# EasyEDA Pro project ProPrj_STM32G431 FOC_2026-07-29.epro, board PCB1
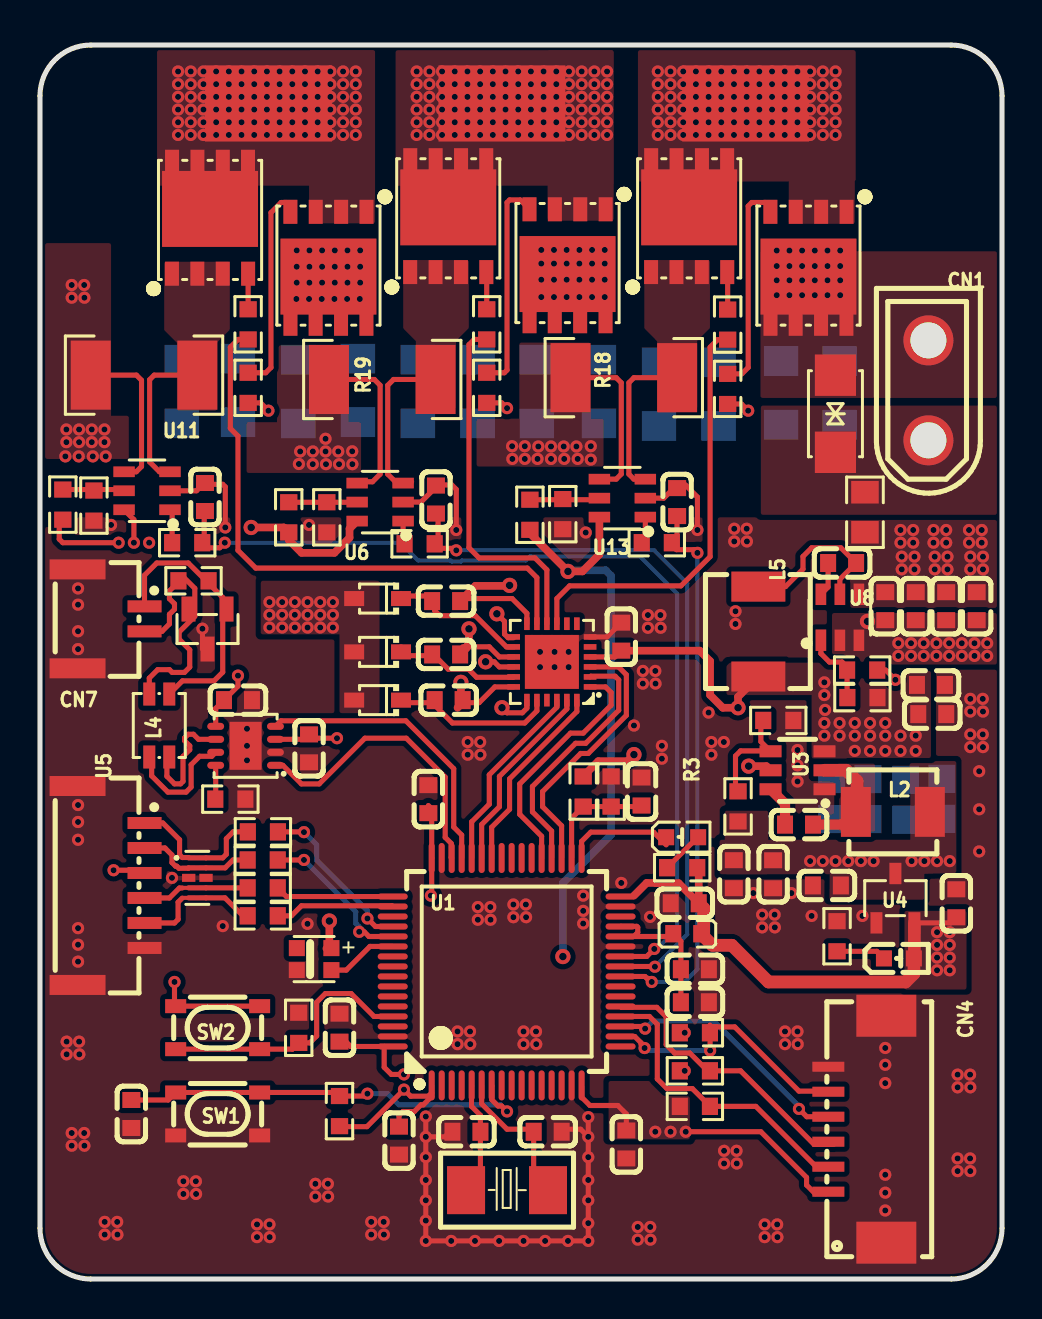
[diagram p1: board, top side]
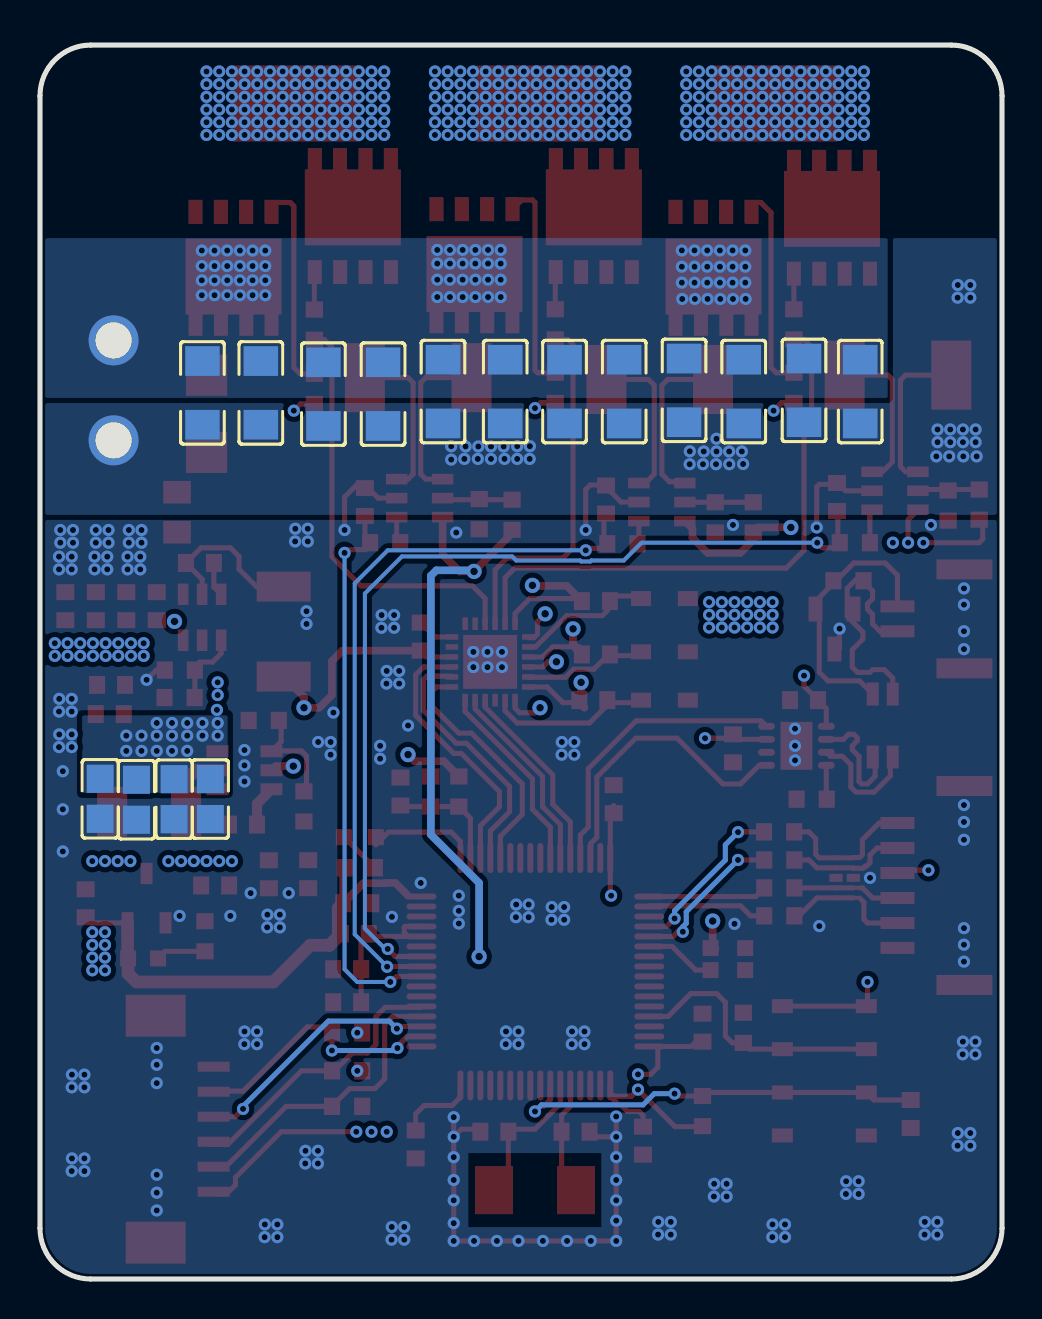
[diagram p2: board, bottom side, seen from below]

Outline 48.13 x 61.72 mm; copper layers: Top Layer, 内电, 内地, Bottom Layer. Coordinates in mm from the lower left corner of the outline.
Outline path: 0,59.18 0,2.54 arc(0.74,0.74) 2.54,0 45.59,0 arc(47.39,0.74) 48.13,2.54 48.13,59.18 arc(47.39,60.98) 45.59,61.72 2.54,61.72 arc(0.74,60.98) 0,59.18
Stack: Top Layer 0.035mm Outer layer thickness 1oz / Dielectric1 0.2104mm 7628 RC49% 8.6mil / 内电 0.0152mm Inner layer thickness / Dielectric2 1.065mm 1.1mm H/HOZ Copper / 内地 0.0152mm Inner layer thickness / Dielectric3 0.2104mm 7628 RC49% 8.6mil / Bottom Layer 0.035mm Outer layer thickness 1oz

## Design rules (mm)
net FDCAN_RX: DP3
net FDCAN_TX: DP3
net CAN1L: DP5
net CAN1H: DP5
net FDCAN1_H: DP4
net FDCAN1_L: DP4
spacing copperThickness1oz (default): track to track 0.102, other pairs 0.152 to 0.3
spacing copperThickness2oz: track to track 0.203, other pairs 0.152 to 0.3
track width copperThickness1oz (default): min 0.127, default 0.254, max 2.54
track width copperThickness2oz: min 0.203, default 0.254, max 2.54
differential pair differentialPair (default): width min 0.127, default 0.254, max 2.54; gap min 0.152, default 0.152
net VCC_INPUT uses copperRegion
net PGND uses copperRegion
net VGS uses copperRegion
net GND uses copperRegion
net $1N50 uses copperRegion
net +5V uses copperRegion
net +3.3V uses copperRegion
net VS1 uses copperRegion
net L3+ uses copperRegion

## Placement (name value [footprint] x y rotation side)
C1  18nF  [C0603]  31.88 38.86 90 top
C2  18nF  [C0603]  19.81 38.99 90 top
C3  100nF  [C0603]  9.91 28.96 180 top
C4  18nF  [C0603]  8.25 39.12 90 top
C5  10uF  [C0603]  44.58 29.72 180 top
C6  10uF  [C0603]  44.64 28.26 180 top
C7  100nF  [C0603]  37.98 22.73 0 top
C8  22uF  [C0603]  34.71 20.25 90 top
C9  22uF  [C0603]  36.68 20.25 90 top
C10  100nF  [C0603]  39.37 19.69 0 top
C11  100nF  [C0603]  45.85 18.79 270 top
C12  10uF  [C1206]  37.08 44.32 90 bottom
C13  10uF  [C1206]  40 44.32 90 bottom
C14  10uF  [C1206]  27.97 44.39 90 bottom
C15  10uF  [C1206]  24.86 44.39 90 bottom
C16  10uF  [C1206]  12.92 44.39 90 bottom
C17  10uF  [C1206]  15.91 44.45 90 bottom
C18  10uF  [C1206]  9.91 44.45 90 bottom
C19  10uF  [C1206]  7.1 44.39 90 bottom
C20  10uF  [C1206]  21.89 44.39 90 bottom
C21  10uF  [C1206]  18.9 44.39 90 bottom
C22  10uF  [C1206]  33.95 44.26 90 bottom
C23  10uF  [C1206]  30.97 44.26 90 bottom
C24  100nF  [C0603]  29.34 6.73 90 top
C25  100nF  [C0603]  19.43 24 270 top
C26  100nF  [C0603]  14.99 12.57 270 top
C27  1uF  [C0603]  29.08 32.13 270 top
C28  100nF  [C0603]  32.26 18.8 0 top
C29  100nF  [C0603]  32.77 15.49 180 top
C30  1uF  [C0603]  20.32 33.91 180 top
C31  100nF  [C0603]  30.1 24.38 270 top
C32  22uF  [C0805]  45.12 24.02 90 bottom
C33  22uF  [C0805]  43.31 23.97 90 bottom
C34  22uF  [C0805]  41.42 24 270 bottom
C35  22uF  [C0805]  39.61 24.01 270 bottom
C36  33pF  [C0603]  25.4 7.37 180 top
C37  100nF  [C0603]  13.46 26.54 90 top
C38  33pF  [C0603]  21.34 7.37 0 top
C39  100nF  [C0603]  4.57 8.26 90 top
C40  100nF  [C0603]  32.77 13.84 180 top
C41  1uF  [C0603]  20.32 31.24 180 top
C42  1uF  [C0603]  20.45 28.96 180 top
C43  100nF  [C0603]  40.13 35.81 180 top
C44  100nF  [C0603]  42.29 33.66 270 top
C45  1uF  [C0603]  43.81 33.66 90 top
C46  1uF  [C0603]  45.34 33.66 90 top
C47  1uF  [C0603]  46.86 33.66 90 top
C48  100nF  [C0603]  17.96 6.92 90 top
CN1  XT30UPB-M  [CONN-TH_XT30UPB-M]  44.45 44.45 90 top
CN4  1.25-6P WT  [CONN-SMD_1.25-6PWT]  40.89 7.49 270 top
CN7  WAFER-GH1.25-2PLB  [CONN-TH_2P-P1.25_XUNPU_WAFER-GH1.25-2PLB]  3.56 33.02 270 top
D1  RCLAMP0524P  [DFN2510-10_L2.5-W1.0-P0.50-BL]  7.87 20.07 270 top
D2  SM712  [SOT-23-3_L2.9-W1.3-P1.90-LS2.4-BR]  8.38 32.51 90 top
D11  B16WS  [SOD-323_L1.8-W1.3-LS2.5-RD]  16.89 34.04 180 top
D12  B16WS  [SOD-323_L1.8-W1.3-LS2.5-RD]  16.89 31.37 180 top
D13  B16WS  [SOD-323_L1.8-W1.3-LS2.5-RD]  16.89 28.96 180 top
L2  3.3uH  [IND-SMD_L4.4-W4.2_SPM4020T]  42.67 23.37 0 top
L3  GZ1608D601TF  [L0603]  32.38 17.27 180 top
L4  ACT1210-510-2P-TL00  [FILTER-SMD_4P-L3.2-W2.5-BL_ACT1210]  5.97 27.69 0 top
L5  15uH  [IND-SMD_L5.7-W5.2_GSM0530]  35.94 32.39 270 top
LED1  KT-0603R  [LED-SMD_L1.6-W0.8-R-RD]  42.97 16.04 0 top
LED2  KT-0603W  [LED0603-R-RD_WHITE]  32.13 22.1 0 top
LED3  WS2812B-2020-V6  [LED-SMD_4P-L2.2-W2.0-P1.00_WS2815C-2020-4P]  13.72 16 0 top
NOREF  -  [Pad_e1544]  23.11 58.8 0 top
NOREF#2  -  [Pad_e1545]  35.31 58.8 0 top
NOREF#3  -  [Pad_e1543]  11.43 58.8 0 top
Q1  HYG053N10NS1C2  [PDFN-8_L5.8-W5.0-P1.27-LS6.2-BL]  38.45 50.58 180 top
Q2  HYG053N10NS1C2  [PDFN-8_L5.8-W5.0-P1.27-LS6.2-BL]  26.4 50.71 180 top
Q3  HYG053N10NS1C2  [PDFN-8_L5.8-W5.0-P1.27-LS6.2-BL]  14.43 50.58 180 top
Q4  HYG053N10NS1C2  [PDFN-8_L5.8-W5.0-P1.27-LS6.2-BL]  32.48 53.17 0 top
Q5  HYG053N10NS1C2  [PDFN-8_L5.8-W5.0-P1.27-LS6.2-BL]  20.43 53.17 0 top
Q6  HYG053N10NS1C2  [PDFN-8_L5.8-W5.0-P1.27-LS6.2-BL]  8.51 53.09 0 top
R1  220Ω  [R0603]  30.86 36.83 0 top
R2  220Ω  [R0603]  18.99 36.78 180 top
R3  56.2kΩ  [R0603]  34.93 23.64 270 top
R4  10kΩ  [R0603]  36.94 27.94 180 top
R5  1kΩ  [R0603]  39.88 17.15 270 top
R6  0Ω  [R0805]  41.28 38.35 270 top
R7  33Ω  [R0603]  34.41 44.52 270 top
R8  1kΩ  [R0603]  9.53 24 0 top
R9  33Ω  [R0603]  22.35 44.58 270 top
R10  33Ω  [R0603]  10.41 44.58 270 top
R11  33Ω  [R0603]  11.15 22.37 180 top
R12  33Ω  [R0603]  11.14 20.96 180 top
R13  33Ω  [R0603]  11.14 19.56 180 top
R14  33Ω  [R0603]  34.41 47.74 270 top
R15  33Ω  [R0603]  11.14 18.17 180 top
R16  33Ω  [R0603]  22.35 47.75 270 top
R17  33Ω  [R0603]  10.41 47.75 270 top
R18  1mΩ  [RES-SMD_L6.3-W3.2_R2512]  29.21 45.09 0 top
R19  1mΩ  [RES-SMD_L6.3-W3.2_R2512]  17.12 45 0 top
R20  1mΩ  [RES-SMD_L6.3-W3.2_R2512]  5.21 45.21 0 top
R21  22kΩ  [R0603]  24.51 38.23 270 top
R22  22kΩ  [R0603]  26.16 38.26 90 top
R23  120Ω  [R0603]  7.68 34.93 0 top
R24  22kΩ  [R0603]  12.45 38.1 270 top
R25  22kΩ  [R0603]  14.35 38.1 90 top
R27  22kΩ  [R0603]  1.14 38.74 270 top
R28  22kΩ  [R0603]  2.7 38.69 90 top
R30  1kΩ  [R0603]  12.95 12.56 90 top
R31  1kΩ  [R0603]  14.99 8.4 270 top
R32  1kΩ  [R0603]  32.13 20.57 180 top
R33  10kΩ  [R0603]  32.77 8.64 0 top
R34  1kΩ  [R0603]  28.57 24.38 270 top
R35  15kΩ  [R0603]  27.18 24.38 90 top
R36  10kΩ  [R0603]  32.77 10.41 0 top
R37  10kΩ  [R0603]  32.77 12.32 0 top
R38  100kΩ  [R0603]  41.15 29.08 180 top
R39  220Ω  [R0603]  7.37 36.83 0 top
R40  8.66kΩ  [R0603]  41.14 30.46 180 top
SW1  SKRPACE010  [KEY-SMD_4P-L4.2-W3.2-P2.20-LS4.6]  8.89 8.26 0 top
SW2  SKRPACE010  [KEY-SMD_4P-L4.2-W3.2-P2.20-LS4.6]  8.89 12.57 0 top
U1  STM32G474RBT6  [LQFP-64_L10.0-W10.0-P0.50-LS12.0-BL]  23.35 15.37 0 top
U3  TPS563209DDCR  [SOT-23-6_L2.9-W1.6-P0.95-LS2.8-BR]  37.9 25.45 0 top
U4  XC6206P332MR-G  [SOT-23-3_L2.9-W1.6-P1.90-LS2.8-BR]  42.8 19.05 270 top
U5  WAFER-GH1.25-6PLB  [CONN-SMD_6P-P1.25_XUNPU_WAFER-GH1.25-6PLB]  3.56 19.69 270 top
U6  INA181A2IDBVR  [SOT-23-6_L2.9-W1.6-P0.95-LS2.8-BL]  17.02 38.86 90 top
U7  SIT1044QTK/3  [TDFN-8_L3.0-W3.0-P0.65-BL-EP]  10.29 26.67 90 top
U8  LMR51625YDDCR  [SOT-23-6_L2.9-W1.6-P0.95-LS2.8-BL]  40.02 33.1 0 top
U9  SMAJ28CA  [DO-214AC_L4.3-W2.7-LS5.0-BI]  39.8 43.28 90 top
U11  INA181A2IDBVR  [SOT-23-6_L2.9-W1.6-P0.95-LS2.8-BL]  5.36 39.43 90 top
U12  JSM6288Q  [VQFN-24_L4.0-W4.0-P0.50-TL-EP2.7]  25.61 30.87 180 top
U13  INA181A2IDBVR  [SOT-23-6_L2.9-W1.6-P0.95-LS2.8-BL]  29.14 39.06 90 top
X1  8MHz  [CRYSTAL-SMD_L5.0-W3.2]  23.37 4.45 180 top

## Footprints (pads in the part's own frame, mm; a bottom-side part is the same pattern mirrored in y, then rotated)
C0603
  rect 0.8x0.9 smd: 1(-0.7,0) 2(0.7,0)
C0805
  rect 1.41x1.35 smd: 1(-1,0) 2(1,0)
C1206
  rect 1.485x1.728 smd: 1(-1.593,0) 2(1.593,0)
CONN-SMD_1.25-6PWT
  rect 0.5x1.6 smd: 1(3.125,-1.45) 2(1.875,-1.45) 3(0.625,-1.45) 4(-0.625,-1.45) 5(-1.875,-1.45) 6(-3.125,-1.45)
  rect 2.1x3 smd: 7(-5.675,1.45) 8(5.675,1.45)
CONN-SMD_6P-P1.25_XUNPU_WAFER-GH1.25-6PLB
  rect 0.6x1.7 smd: 1(-3.125,1.675) 2(-1.875,1.675) 3(-0.625,1.675) 4(0.625,1.675) 5(1.875,1.675) 6(3.125,1.675)
  rect 1x2.8 smd: 7(4.975,-1.675) 8(-4.975,-1.675)
CONN-TH_2P-P1.25_XUNPU_WAFER-GH1.25-2PLB
  rect 0.6x1.7 smd: 1(-0.625,1.675) 2(0.625,1.675)
  rect 1x2.8 smd: 3(2.475,-1.675) 4(-2.475,-1.675)
CONN-TH_XT30UPB-M
  round 2.5 hole 1.8: 1(-2.5,0) 2(2.5,0)
CRYSTAL-SMD_L5.0-W3.2
  rect 1.9x2.4 smd: 1(-2.05,0) 2(2.05,0)
DFN2510-10_L2.5-W1.0-P0.50-BL
  rect 0.2x0.665 smd: 1(-1,-0.433) 2(-0.5,-0.433) 4(0.5,-0.433) 5(1,-0.433) 6(1,0.433) 7(0.5,0.433) 9(-0.5,0.433) 10(-1,0.433)
  rect 0.4x0.665 smd: 3(0,-0.433) 8(0,0.433)
DO-214AC_L4.3-W2.7-LS5.0-BI
  rect 2.07x2.06 smd: 1(-1.929,0) 2(1.929,0)
FILTER-SMD_4P-L3.2-W2.5-BL_ACT1210
  rect 0.6x1.15 smd: 1(-0.5,-1.575) 2(0.5,-1.575) 3(0.5,1.575) 4(-0.5,1.575)
IND-SMD_L4.4-W4.2_SPM4020T
  rect 1.5x2.5 smd: 1(-1.85,0) 2(1.85,0)
IND-SMD_L5.7-W5.2_GSM0530
  rect 1.5x2.7 smd: 1(-2.25,0) 2(2.25,0)
KEY-SMD_4P-L4.2-W3.2-P2.20-LS4.6
  rect 1.05x0.7 smd: 1(-2.1,1.075) 2(2.1,1.075) 3(-2.1,-1.075) 4(2.1,-1.075)
L0603
  rect 0.8x0.864 smd: 1(-0.7,0) 2(0.7,0)
LED0603-R-RD_WHITE
  rect 0.8x0.8 smd: 1(0.8,0) 2(-0.8,0)
LED-SMD_4P-L2.2-W2.0-P1.00_WS2815C-2020-4P
  rect 0.8x0.8 smd: 1(-0.865,0.55) 2(-0.865,-0.55) 3(0.865,-0.55) 4(0.865,0.55)
LED-SMD_L1.6-W0.8-R-RD
  rect 0.8x0.8 smd: 1(0.75,0) 2(-0.75,0)
LQFP-64_L10.0-W10.0-P0.50-LS12.0-BL
  oval 0.3x1.5 smd: 1(-3.75,-5.688) 2(-3.25,-5.688) 3(-2.75,-5.688) 4(-2.25,-5.688) 5(-1.75,-5.688) 6(-1.25,-5.688) 7(-0.75,-5.688) 8(-0.25,-5.688) 9(0.25,-5.688) 10(0.75,-5.688) 11(1.25,-5.688) 12(1.75,-5.688) 13(2.25,-5.688) 14(2.75,-5.688) 15(3.25,-5.688) 16(3.75,-5.688) 33(3.75,5.688) 34(3.25,5.688) 35(2.75,5.688) 36(2.25,5.688) 37(1.75,5.688) 38(1.25,5.688) 39(0.75,5.688) 40(0.25,5.688) 41(-0.25,5.688) 42(-0.75,5.688) 43(-1.25,5.688) 44(-1.75,5.688) 45(-2.25,5.688) 46(-2.75,5.688) 47(-3.25,5.688) 48(-3.75,5.688)
  oval 1.5x0.3 smd: 17(5.7,-3.738) 18(5.7,-3.238) 19(5.7,-2.738) 20(5.7,-2.238) 21(5.7,-1.738) 22(5.7,-1.238) 23(5.7,-0.739) 24(5.7,-0.238) 25(5.7,0.262) 26(5.7,0.762) 27(5.7,1.262) 28(5.7,1.762) 29(5.7,2.261) 30(5.7,2.762) 31(5.7,3.261) 32(5.7,3.762) 49(-5.7,3.762) 50(-5.7,3.261) 51(-5.7,2.762) 52(-5.7,2.261) 53(-5.7,1.762) 54(-5.7,1.262) 55(-5.7,0.762) 56(-5.7,0.262) 57(-5.7,-0.238) 58(-5.7,-0.739) 59(-5.7,-1.238) 60(-5.7,-1.738) 61(-5.7,-2.238) 62(-5.7,-2.738) 63(-5.7,-3.238) 64(-5.7,-3.738)
Pad_e1543
  rect 6.35x3.81 smd: 1(0,0)
Pad_e1544
  rect 6.35x3.81 smd: 1(0,0)
Pad_e1545
  rect 6.35x3.81 smd: 1(0,0)
PDFN-8_L5.8-W5.0-P1.27-LS6.2-BL
  rect 0.7x1.2 smd: 1(-1.905,-2.8) 2(-0.635,-2.8) 3(0.635,-2.8) 4(1.905,-2.8) 5(1.9,2.8) 6(0.64,2.8) 7(-0.63,2.8) 8(-1.9,2.8)
  rect 4.8x3.8 smd: 9(0,0.44)
R0603
  rect 0.806x0.864 smd: 1(-0.753,0) 2(0.753,0)
R0805
  rect 1.133x1.377 smd: 1(-1,0) 2(1,0)
RES-SMD_L6.3-W3.2_R2512
  rect 2x3.456 smd: 1(-2.667,0) 2(2.667,0)
SOD-323_L1.8-W1.3-LS2.5-RD
  rect 1x0.75 smd: 1(-1.173,0) 2(1.173,0)
SOT-23-3_L2.9-W1.3-P1.90-LS2.4-BR
  rect 1.25x0.7 smd: 1(1,-0.95) 2(1,0.95) 3(-1,0)
SOT-23-3_L2.9-W1.6-P1.90-LS2.8-BR
  rect 1.07x0.6 smd: 1(1.235,-0.95) 2(1.235,0.95) 3(-1.235,0)
SOT-23-6_L2.9-W1.6-P0.95-LS2.8-BL
  rect 0.532x1.072 smd: 1(-0.95,-1.149) 2(0,-1.149) 3(0.95,-1.149) 4(0.95,1.149) 5(0,1.149) 6(-0.95,1.149)
SOT-23-6_L2.9-W1.6-P0.95-LS2.8-BR
  rect 1.1x0.6 smd: 1(1.35,-0.95) 2(1.35,0) 3(1.35,0.95) 4(-1.35,0.95) 5(-1.35,0) 6(-1.35,-0.95)
TDFN-8_L3.0-W3.0-P0.65-BL-EP
  oval 0.35x0.84 smd: 1(-0.975,-1.495) 2(-0.325,-1.495) 3(0.325,-1.495) 4(0.975,-1.495) 5(0.975,1.495) 6(0.325,1.495) 7(-0.325,1.495) 8(-0.975,1.495)
  rect 2.4x1.6 smd: 9(0,0)
VQFN-24_L4.0-W4.0-P0.50-TL-EP2.7
  rect 0.633x0.28 smd: 1(-1.911,1.25) 2(-1.911,0.75) 3(-1.911,0.25) 4(-1.911,-0.25) 5(-1.911,-0.75) 6(-1.911,-1.25) 13(1.911,-1.25) 14(1.911,-0.75) 15(1.911,-0.25) 16(1.911,0.25) 17(1.911,0.75) 18(1.911,1.25)
  rect 0.28x0.633 smd: 7(-1.25,-1.911) 8(-0.75,-1.911) 9(-0.25,-1.911) 10(0.25,-1.911) 11(0.75,-1.911) 12(1.25,-1.911) 19(1.25,1.911) 20(0.75,1.911) 21(0.25,1.911) 22(-0.25,1.911) 23(-0.75,1.911) 24(-1.25,1.911)
  rect 2.7x2.7 smd: 25(0,0)

## Nets
As in the schematic, except:
VS1: C30.1 NOREF#2.1 Q1.1 Q1.2 Q1.3 Q4.5 Q4.6 Q4.7 Q4.8 Q4.9 U12.12
VS2: C41.1 NOREF.1 Q2.1 Q2.2 Q2.3 Q5.5 Q5.6 Q5.7 Q5.8 Q5.9 U12.15
VS3: C42.1 NOREF#3.1 Q3.1 Q3.2 Q3.3 Q6.5 Q6.6 Q6.7 Q6.8 Q6.9 U12.18

Pads without a net: LED3 1; U1 2 3 4 8 9 10 11 12 13 14 17 22 23 30 38 39 40 41 51 55 56 57 58 59 60 62; U12 5 7 8 21

## Via types
v1: diameter 0.61, hole 0.305, Top Layer to Bottom Layer, 695 vias
v2: diameter 0.762, hole 0.381, Top Layer to Bottom Layer, 14 vias

## Routing (per net, layer and track width the routed paths; a pad name or vN(x,y) marks a point on that pad's centre or on a via; arc(x,y) is an arc through that point)
+3.3V: length 106.8
  Top Layer w0.254: U7.5 8.79,28.54 C3.2 9.91,29.66 v1(9.91,30.18) ; v1(18.21,10.24) 17.58,10.24 17.22,10.59 17.22,11.63 ; C48.2 17.96,8.18 18.16,8.38 18.73,8.38 19.06,8.71 19.18,8.71 19.6,9.13 19.6,9.31 ; v1(3.94,36.83) 1.14,36.83 0.96,37.01 0.96,37.8 R27.2 ; 19.6,9.31 19.43,9.14 18.54,9.14 v1(18.21,9.47) 16.36,7.62 15.01,7.62 R31.2 ; 19.6,9.31 19.6,9.68 ; U11.6 4.7,37.99 v1(4.7,36.83) ; v1(6.73,14.86) 6.73,13.71 SW2.1 10.99,13.65 ; v1(3.68,20.45) 5.09,20.45 U5.3 ; 17.22,11.63 15.55,11.63 15.31,11.87 C26.2 ; 17.22,11.63 U1.64 ; U4.2 45.57,17.82 C11.2 ; 19.43,23.68 19.6,23.52 U1.48 19.6,19.22 v1(19.56,19.18) ; C24.2 29.34,8.26 28.91,8.68 27.52,8.68 27.1,9.1 27.1,9.68 ; 39.44,4.37 39.34,4.27 38.79,4.27 38.35,4.7 38.35,5.08 36.07,7.37 v1(32.31,7.37)
  Top Layer w0.381: 29.72,19.18 30.35,19.81 30.82,19.81 30.83,19.8 31.95,19.8 C28.2 32.96,20.5 R32.1 ; v2(10.57,37.59) 12.2,37.59 R24.2 12.45,36.97 13.09,36.32 14.73,36.32 15.49,37.08 15.49,37.53 U6.6 ; U13.6 27.99,36.24 27.14,35.39 v2(26.42,35.39) 24.51,37.3 R21.2
  Top Layer w0.635: U4.2 43.75,16.06 LED1.1 43.72,15.28 43.31,14.86 36.45,14.86 34.62,16.69 33.65,16.69 33.21,17.13 33.21,18.55 C28.2
  Bottom Layer w0.381: v2(26.42,35.39) 26.47,35.45 28.31,35.45 28.57,35.18 28.57,22.23 26.16,19.81 v2(26.16,16.13)
  vias: v1(5.46,36.83) v1(30.78,7.37) v1(31.55,7.37) v1(32.26,12.32) v1(32.26,10.41) v1(44.88,17.35) v1(44.88,16.71) v1(44.88,16.08) v1(44.88,15.44) v1(45.52,17.35) v1(45.52,16.71) v1(45.52,16.08) v1(45.52,15.44)
+5V: length 4.7
  Top Layer w0.254: U7.3 13.21,27 C37.2 13.65,27.05 v1(14.86,27.05)
  Top Layer w0.381: v2(14.48,17.91) 14.48,16.68 14.33,16.53
  vias: v1(38.53,20.9) v1(39.17,20.9) v1(39.8,20.9) v1(40.44,20.9) v1(41.07,20.9) v1(41.71,20.9) v1(43.61,20.9) v1(44.25,20.9) v1(44.88,20.9) v1(45.52,20.9)
GND: length 42.8
  Top Layer w0.254: v1(19.3,7.11) v1(19.3,6.1) v1(19.3,4.95) v1(19.3,3.94) v1(19.3,2.92) v1(19.3,1.91) v1(20.57,1.91) v1(21.76,1.91) v1(22.97,1.91) v1(24.19,1.91) v1(25.27,1.91) v1(26.42,1.91) v1(27.43,1.91) v1(27.43,2.79) v1(27.43,3.94) v1(27.43,4.95) v1(27.43,6.1) v1(27.43,7.11) ; v1(19.3,7.11) v1(19.3,8.13) ; v1(19.3,7.11) 20.25,7.11 20.64,7.49 ; R40.1 42.31,30.46 v1(42.8,29.97) ; v1(9.27,37.59) 9.27,39.62 9.14,39.75 8.28,39.75 8.22,39.81 7.83,39.43 U11.2 ; v1(32.89,37.47) 32.89,39.12 32.29,39.72 31.87,39.72 31.21,39.06 U13.2 ; v1(20.83,37.47) 20.83,39.5 20.6,39.72 19.92,39.72 19.06,38.86 17.8,38.86 ; v1(8.13,32.53) 8.13,31.51 ; v1(27.43,7.11) v1(27.43,8.1) ; v1(27.43,7.11) 27.05,7.49 26.1,7.49 ; U12.6 28.37,32.12 C27.1
  vias: v1(1.33,11.87) v1(1.33,11.24) v1(1.59,7.3) v1(1.59,6.67) v1(1.91,34.54) v1(1.91,33.73) v1(1.91,32.4) v1(1.91,31.51) v1(1.91,23.71) v1(1.91,22.86) v1(1.91,21.97) v1(1.91,17.55) v1(1.91,16.72) v1(1.91,15.88) v1(1.96,11.87) v1(1.97,11.24) v1(2.21,7.3) v1(2.22,6.67) v1(3.24,2.86) v1(3.24,2.22) v1(3.56,37.72) v1(3.86,2.86) v1(3.87,2.22) v1(6.6,20.07) v1(7.18,4.89) v1(7.18,4.25) v1(7.8,4.89) v1(7.81,4.25) v1(9.14,17.65) v1(10.36,27.52) v1(10.36,26.67) v1(10.36,25.94) v1(10.86,2.73) v1(10.86,2.1) v1(11.48,2.73) v1(11.49,2.1) v1(13.38,17.77) v1(13.46,37.72) v1(13.78,4.76) v1(13.78,4.13) v1(14.4,4.76) v1(14.41,4.13) v1(16.57,2.86) v1(16.57,2.22) v1(17.2,2.86) v1(17.21,2.22) v1(20.89,12.38) v1(20.89,11.75) v1(21.4,26.86) v1(21.4,26.23) v1(21.52,12.38) v1(21.53,11.75) v1(21.91,18.61) v1(21.91,17.97) v1(22.02,26.86) v1(22.03,26.23) v1(22.53,18.61) v1(22.54,17.97) v1(23.69,18.73) v1(23.69,18.1) v1(24.19,12.38) v1(24.19,11.75) v1(24.31,18.73) v1(24.32,18.1) v1(24.82,12.38) v1(24.83,11.75) v1(25.02,31.37) v1(25.02,30.61) v1(25.75,31.37) v1(25.75,30.61) v1(26.45,31.37) v1(26.45,30.61) v1(27.18,19.18) v1(27.18,18.42) v1(27.18,17.78) v1(27.31,37.34) v1(29.08,19.81) v1(29.72,27.69) v1(29.91,2.6) v1(29.91,1.97) v1(30.16,30.42) v1(30.16,29.78) v1(30.42,33.21) v1(30.42,32.58) v1(30.53,18.12) v1(30.53,2.6) v1(30.54,1.97) v1(30.79,30.42) v1(30.8,29.78) v1(31.04,33.21) v1(31.05,32.58) v1(31.12,26.67) v1(31.12,26.03) v1(33.45,28.33) v1(33.59,26.86) v1(33.59,26.23) v1(34.22,26.86) v1(34.23,6.41) v1(34.23,5.78) v1(34.73,37.53) v1(34.73,36.89) v1(34.8,33.4) v1(34.8,32.77) v1(34.85,6.41) v1(34.86,5.78) v1(35.36,37.53) v1(35.37,36.89) v1(35.69,19.3) v1(36.13,18.22) v1(36.13,17.59) v1(36.26,2.73) v1(36.26,2.1) v1(36.76,18.22) v1(36.77,17.59) v1(36.88,2.73) v1(36.89,2.1) v1(37.27,12.38) v1(37.27,11.75) v1(37.59,19.3) v1(37.9,26.46) v1(37.9,25.69) v1(37.9,24.89) v1(37.9,12.38) v1(37.91,11.75) v1(38.61,18.16) v1(41.15,18.16) v1(42.29,11.56) v1(42.29,10.72) v1(42.29,9.8) v1(42.29,5.22) v1(42.29,4.32) v1(42.29,3.43) v1(43.05,37.47) v1(43.05,36.83) v1(43.12,36.13) v1(43.12,35.5) v1(43.69,37.47) v1(43.69,36.83) v1(43.75,36.13) v1(43.75,35.5) v1(44.7,37.47) v1(44.7,36.83) v1(44.77,36.13) v1(44.77,35.5) v1(45.34,37.47) v1(45.34,36.83) v1(45.4,36.13) v1(45.4,35.5) v1(45.91,10.22) v1(45.91,9.59) v1(45.91,6.03) v1(45.91,5.4) v1(46.48,37.47) v1(46.48,36.83) v1(46.55,36.13) v1(46.55,35.5) v1(46.55,29.02) v1(46.55,28.38) v1(46.55,27.24) v1(46.55,26.61) v1(46.53,10.22) v1(46.55,9.59) v1(46.53,6.03) v1(46.55,5.4) v1(46.99,25.4) v1(46.99,23.5) v1(46.99,21.39) v1(47.12,37.47) v1(47.12,36.83) v1(47.18,36.13) v1(47.18,35.5) v1(47.17,29.02) v1(47.18,28.38) v1(47.17,27.24) v1(47.18,26.61)
PGND: length 25.1
  Top Layer w0.254: U11.4 4.82,40.38 5.08,40.64 5.08,44.96 4.83,45.21 R20.1 ; 15.57,39.88 16.64,39.88 17.02,40.26 17.02,44.7 16.73,45 R19.1 ; R18.1 28.83,45.09 29.08,44.83 29.08,40.26 28.83,40.01 U13.4
  vias: v1(1.27,41.15) v1(1.32,42.49) v1(1.32,41.86) v1(1.59,49.72) v1(1.59,49.09) v1(1.96,42.49) v1(1.96,41.86) v1(1.94,41.15) v1(2.21,49.72) v1(2.22,49.09) v1(2.59,42.49) v1(2.59,41.86) v1(2.64,41.15) v1(3.23,42.49) v1(3.23,41.86) v1(3.29,41.15) v1(12.95,40.77) v1(13.02,41.39) v1(13.65,41.39) v1(13.65,40.76) v1(14.29,42.03) v1(14.29,41.39) v1(14.31,40.76) v1(14.92,41.39) v1(14.96,40.76) v1(15.62,41.4) v1(15.63,40.76) v1(23.62,41.66) v1(23.63,41.02) v1(24.26,41.66) v1(24.26,41.02) v1(24.93,41.64) v1(24.89,41.02) v1(25.57,41.64) v1(25.57,41.02) v1(26.2,41.64) v1(26.23,41.02) v1(26.84,41.64) v1(26.9,41.02) v1(27.56,41.66) v1(27.56,40.99)
VCC_INPUT: length 19.5
  Top Layer w0.381: v2(29.72,26.23) 29.39,25.9 27.93,25.9 27.17,25.14
  内电 w0.381: v2(29.72,26.23) 29.72,26.67 30.73,27.69 33.78,27.69 34.16,28.07 34.16,31.12 35.94,32.89 v2(41.4,32.89)
  vias: v1(12.84,51.45) v1(12.84,50.63) v1(12.84,49.84) v1(12.83,49.02) v1(13.48,51.45) v1(13.48,50.63) v1(13.48,49.84) v1(13.46,49.02) v1(14.12,51.45) v1(14.12,50.63) v1(14.12,49.84) v1(14.1,49.02) v1(14.75,51.45) v1(14.75,50.63) v1(14.75,49.84) v1(14.73,49.02) v1(15.38,51.45) v1(15.38,50.63) v1(15.38,49.84) v1(15.37,49.02) v1(16.02,51.45) v1(16.02,50.63) v1(16.02,49.84) v1(16,49.02) v1(25.08,51.47) v1(25.08,50.79) v1(25.08,49.99) v1(25.08,49.12) v1(25.72,51.47) v1(25.72,50.79) v1(25.72,49.99) v1(25.72,49.12) v1(26.35,51.47) v1(26.35,50.79) v1(26.35,49.99) v1(26.35,49.12) v1(26.99,51.47) v1(26.99,50.79) v1(26.99,49.99) v1(26.99,49.12) v1(27.62,51.47) v1(27.62,50.79) v1(27.62,49.99) v1(27.62,49.12) v1(28.26,51.47) v1(28.26,50.79) v1(28.26,49.99) v1(28.26,49.12) v1(36.86,51.44) v1(36.86,50.67) v1(36.86,49.95) v1(36.86,49.21) v1(37.5,51.44) v1(37.5,50.67) v1(37.5,49.95) v1(37.5,49.21) v1(38.13,51.44) v1(38.13,50.67) v1(38.13,49.95) v1(38.13,49.21) v1(38.77,51.44) v1(38.77,50.67) v1(38.77,49.95) v1(38.77,49.21) v1(39.4,51.44) v1(39.4,50.67) v1(39.4,49.95) v1(39.4,49.21) v1(40.04,51.44) v1(40.04,50.67) v1(40.04,49.95) v1(40.04,49.21) v1(42.94,31.8) v1(42.94,31.17) v1(43.58,31.8) v1(43.58,31.17) v1(44.22,31.8) v1(44.22,31.17) v1(44.85,31.8) v1(44.85,31.17) v1(45.48,31.8) v1(45.48,31.17) v1(46.12,31.8) v1(46.12,31.17) v1(46.75,31.8) v1(46.75,31.17) v1(47.39,31.8) v1(47.39,31.17)
VDDA: length 7.7
  Top Layer w0.254: 29.71,17.13 29.91,17.34 29.91,17.59 29.86,17.64 29.06,17.64 U1.29 ; 29.71,17.13 U1.28 ; 29.71,17.13 31.55,17.13 L3.2 32.07,16.89 C29.2 C40.2
ADC_L1: length 28
  Top Layer w0.254: 31.87,38.32 31.87,36.51 31.85,36.48 32.73,36.48 v1(32.89,36.32) ; U1.24 30.27,15.13 30.37,15.04 30.43,15.04 v1(30.61,14.86)
  Bottom Layer w0.203: v1(32.89,36.32) 32.89,15.49 32.26,14.86 v1(30.61,14.86)
ADC_L2: length 36.7
  Top Layer w0.254: U1.25 30.75,15.63 v1(30.77,15.62) ; v1(20.83,36.45) 20.73,36.55 19.79,36.55 19.92,36.68 19.92,38.32
  Bottom Layer w0.203: v1(20.83,36.45) 30.73,36.45 32.38,34.8 32.38,17.24 v1(30.77,15.62)
ADC_L3: length 47.1
  Top Layer w0.254: 8.22,38.41 8.22,36.64 8.15,36.58 8.99,36.58 v1(9.25,36.83) ; v1(30.73,16.51) 30.36,16.13 U1.26
  Bottom Layer w0.203: v1(9.25,36.83) 18.03,36.83 18.92,35.94 20.55,35.94 20.6,35.89 21.06,35.89 21.11,35.94 24.31,35.94 24.51,36.14 30.02,36.14 31.88,34.29 31.88,17.53 30.86,16.51 v1(30.73,16.51)
ADC_MAIN: length 3.8
  Top Layer w0.254: 30.1,23.68 30.05,23.63 28.57,23.63 27.18,23.63 26.6,23.05
ADC_main: length 2
  Top Layer w0.254: U1.34 26.6,23.05
BOOT0: length 13.5
  Top Layer w0.254: SW2.3 12.63,11.5 R30.1 13.5,11.81 13.84,12.16 13.84,13.84 14.28,14.28 15.57,14.28 16.71,13.13 U1.61
CAN1H: length 13.1
  Top Layer w0.254: CN7.2 6.11,32.4 6.48,32.77 6.48,33.25 6.73,33.5 6.73,33.77 6.48,34.03 6.48,34.42 6.73,34.67 6.73,35.18 7.11,35.18 7.75,34.54 7.75,33.15 6.96,32.36 6.96,32 7.49,31.47 7.49,30.61 7.23,30.34 6.62,30.34 6.48,30.48 5.89,30.48 5.47,30.06 L4.4
CAN1L: length 13.3
  Top Layer w0.254: L4.3 7.13,29.92 8.71,29.92 9.14,30.35 9.14,34.09 7.42,35.81 5.84,35.81 5.23,35.2 CN7.1
ENC_CLK: length 12.7
  Top Layer w0.254: v1(30.28,12.52) 30.17,12.63 U1.19 ; v1(37.97,8.51) 38.36,8.12 39.44,8.12
  Bottom Layer w0.254: v1(37.97,8.51) 37.97,8.64 33.71,12.9 30.66,12.9 v1(30.28,12.52)
ENC_CS: length 13.4
  Top Layer w0.254: v1(33.53,11.43) 33.53,12.53 33.61,12.61 ; v1(30.25,11.55) 30.08,11.73 30.08,11.81 29.75,12.13 U1.18 ; 33.61,12.61 34.76,12.61 37.97,9.4 39.54,9.4 ; 33.61,12.61 33.52,12.7
  Bottom Layer w0.254: v1(33.53,11.43) 30.37,11.43 v1(30.25,11.55)
ENC_MISO: length 15.3
  Top Layer w0.254: U1.20 30.49,13.13 30.89,12.74 30.89,10.01 31.37,9.53 32.64,9.53 33.53,8.64 35.81,8.64 38.86,5.59 39.6,5.59
ENC_MOSI: length 14.3
  Top Layer w0.254: 39.71,6.73 38.73,6.73 35.05,10.41 33.4,10.41 32.51,11.3 31.75,11.3 31.33,11.72 31.33,13.12 30.86,13.59 29.09,13.59 U1.21
FDCAN1_H: length 6.2
  Top Layer w0.254: U7.7 8.6,26.15 7.99,26.15 7.56,25.72 7.56,24.61 7.31,24.35 6.4,24.35 5.59,25.17 5.59,26.37
FDCAN1_L: length 6.2
  Top Layer w0.254: 6.73,24.77 6.35,25.15 6.35,25.99 6.47,26.11 ; 6.73,24.77 7.03,24.77 7.16,24.89 7.16,26.14 7.49,26.47 7.49,26.67 7.24,26.92 7.24,27.07 7.42,27.25 7.68,27.25 7.93,27 U7.6
FDCAN_RX: length 14.7
  Top Layer w0.254: U7.4 12.06,27.92 18.31,27.92 20.7,25.53 20.7,22.61 21.1,22.21 U1.45
FDCAN_TX: length 14.8
  Top Layer w0.254: U1.46 20.57,21.08 20.57,21.79 20.27,22.09 20.27,25.11 18.33,27.05 16.26,27.05 13.97,24.77 13.08,24.77 12.15,25.7 U7.1
HIN1: length 9.7
  Top Layer w0.254: U12.24 26.86,28.39 23.5,25.02 23.5,23.5 22.6,22.6 U1.42
HIN2: length 9.7
  Top Layer w0.254: U12.23 26.36,28.52 22.99,25.14 22.99,23.62 22.1,22.73 U1.43
HIN3: length 9.7
  Top Layer w0.254: U1.44 21.6,22.87 22.48,23.75 22.48,25.22 25.86,28.6 U12.22
HO1: length 24.6
  Top Layer w0.254: v1(35.43,43.43) 35.1,43.77 R7.2 ; 23.7,32.08 23.42,32.08 23.24,32.26 23.24,32.89 v2(22.86,33.27)
  内电 w0.254: v1(35.43,43.43) 34.15,42.15 34.15,34.4 33.78,34.04 22.99,34.04 22.86,33.91 v2(22.86,33.27)
HO2: length 15.8
  Top Layer w0.254: R9.2 23.11,43.82 v1(23.37,43.56) ; 23.7,30.62 22.98,30.62 22.72,30.87 v2(22.29,30.87)
  内电 w0.254: v2(22.29,30.87) 22.2,30.97 22.2,41.63 23.37,42.8 v1(23.37,43.56)
HO3: length 27.9
  Top Layer w0.254: v2(23.11,28.58) 23.37,28.32 24.13,28.32 24.36,28.55 U12.19 ; R10.2 11.04,43.82 v1(11.43,43.43)
  内电 w0.254: v2(23.11,28.58) 20.45,28.58 20.07,28.96 20.07,34.8 19.43,35.43 13.21,35.43 11.43,37.21 v1(11.43,43.43)
L1+: length 8
  Top Layer w0.254: U13.3 29.71,40.01 29.46,40.26 29.46,44.83 29.72,45.09 R18.2
L2+: length 8.3
  Top Layer w0.254: 18.59,39.88 17.78,39.88 17.4,40.26 17.4,44.7 17.69,45 R19.2
L3+: length 7.8
  Top Layer w0.254: R20.2 5.72,45.21 5.49,44.98 5.49,40.87 5.98,40.38 U11.3
LIN1: length 13.5
  Top Layer w0.254: U1.35 26.1,22.67 25.15,23.62 25.15,24.38 27.05,26.29 27.43,26.29 29.34,28.19 29.34,30.23 28.95,30.62 U12.3
LIN2: length 12.9
  Top Layer w0.254: U1.36 25.6,22.41 24.64,23.37 24.64,24.64 26.8,26.8 27.31,26.8 28.96,28.45 28.96,29.97 28.78,30.15 27.56,30.15 U12.2
LIN3: length 12.2
  Top Layer w0.254: U12.1 28.29,29.62 28.57,29.34 28.57,28.7 27.18,27.31 26.54,27.31 24,24.77 24,23.24 25.1,22.15 U1.37
LO1: length 21.3
  Top Layer w0.254: U12.9 25.86,34.04 26.5,34.67 32.07,34.67 33.53,36.13 33.53,46.61 33.9,46.99 34.41,46.99
LO2: length 18.2
  Top Layer w0.254: U12.10 25.36,35.47 24.76,36.07 21.97,36.07 21.46,36.58 21.46,46.74 21.73,47 R16.2
LO3: length 29.2
  Top Layer w0.254: U12.11 24.86,35.08 24.38,35.56 10.79,35.56 9.91,36.45 9.91,42.16 9.53,42.55 9.53,46.61 9.91,47 R17.2
NRST: length 21.2
  Top Layer w0.254: C39.2 6.41,8.96 SW1.1 14.81,9.33 14.99,9.15 16.26,9.15 v1(16.38,9.27) ; v1(23.37,8.38) 23.1,8.65 22.92,8.65 22.61,8.97 22.61,9.68 22.6,9.68
  Bottom Layer w0.254: v1(23.37,8.38) 23.04,8.71 17.96,8.71 17.4,9.27 v1(16.38,9.27)
RCC_OSC_IN: length 5.6
  Top Layer w0.254: 21.32,4.57 22.04,5.29 22.04,8.19 21.59,8.64 21.59,9.67 21.6,9.68
RCC_OSC_OUT: length 7.1
  Top Layer w0.254: 22.1,9.68 22.1,8.76 23.37,7.49 24.45,7.49 24.7,7.24 24.7,5.29 25.42,4.57
SWCLK: length 6
  Top Layer w0.254: U1.50 17.61,18.67 13.08,18.67 12.58,18.17 R15.1
SWCLK1: length 6.2
  Top Layer w0.254: U5.5 6.73,17.81 6.91,17.99 6.91,18.85 7.11,19.05 ; D1.5 D1.6 9.25,19.07 10.15,18.17 R15.2
SWDIO: length 5.9
  Top Layer w0.254: U1.49 12.33,19.13 R13.1
SWDIO1: length 5
  Top Layer w0.254: D1.4 D1.7 10.39,19.57 R13.2 ; U5.4 6.48,19.06 6.97,19.56 7.11,19.56
UART4_RX: length 6
  Top Layer w0.254: U5.2 6.25,21.56 6.6,21.21 6.6,20.83 6.78,20.65 6.85,20.65 6.95,20.55 7.42,20.55 D1.2 D1.9 9.26,20.57 9.66,20.96 R12.2
UART4_RX(PC11): length 7.8
  Top Layer w0.254: R12.1 13.21,20.96 ; U1.53 16.46,17.13 16.22,17.37 v1(15.97,17.37)
  Bottom Layer w0.254: v1(13.21,20.96) 15.8,18.37 15.8,17.79 15.97,17.62 v1(15.97,17.37)
UART4_TX: length 7.3
  Top Layer w0.254: D1.1 D1.10 9.14,21.07 9.32,21.25 9.32,22.02 9.67,22.37 R11.2 ; 7.44,21.08 7.12,21.08 6.98,21.22 6.98,21.97 6.15,22.81 U5.1
UART4_TX(PC10): length 8.4
  Top Layer w0.254: R11.1 13.19,22.37 v1(13.21,22.35) ; v1(16.38,18.03) 16.78,17.63 U1.52
  Bottom Layer w0.254: v1(13.21,22.35) 13.84,21.72 13.84,20.96 16.38,18.42 v1(16.38,18.03)
VB1: length 7.1
  Top Layer w0.254: 23.7,31.62 23.34,31.62 21.78,33.18 20,33.18 19.75,33.43 19.75,34.04 19.62,34.16 18.19,34.16 18.06,34.29
VB2: length 6.4
  Top Layer w0.254: 23.7,30.12 23.68,30.1 21.84,30.1 21.44,30.51 20.42,30.51 19.75,31.18 18.35,31.18 18.06,31.47 18.06,31.62
VB3: length 7.9
  Top Layer w0.254: U12.20 24.86,28.42 24.26,27.81 20.64,27.81 19.62,28.83 18.19,28.83
VGS: length 16.1
  Top Layer w0.254: U12.4 28.77,31.12 C27.2
  Top Layer w0.381: L5.2 34.93,29.12 v2(34.93,28.58) 34.16,28.58 33.53,29.21 33.53,30.91 33,31.43 C27.2 ; v2(35.46,25.65) 36.34,25.65 U3.5
  内电 w0.381: v2(34.93,28.58) 34.93,25.91 35.32,25.51
  vias: v1(11.48,33.86) v1(11.48,33.22) v1(11.48,32.59) v1(12.12,33.86) v1(12.12,33.22) v1(12.12,32.59) v1(12.75,33.86) v1(12.75,33.22) v1(12.75,32.59) v1(13.39,33.86) v1(13.39,33.22) v1(13.39,32.59) v1(14.02,33.86) v1(14.02,33.22) v1(14.02,32.59) v1(14.66,33.86) v1(14.66,33.22) v1(14.66,32.59) v1(39.24,29.85) v1(39.24,29.21) v1(39.28,28.47) v1(39.24,27.81) v1(39.24,27.18) v1(40,27.81) v1(40,27.18) v1(40.77,27.81) v1(40.77,27.18) v1(40.77,26.42) v1(41.53,27.81) v1(41.53,27.18) v1(41.53,26.42) v1(42.29,27.81) v1(42.29,27.18) v1(42.29,26.42) v1(43.05,27.18) v1(43.05,26.42) v1(43.81,27.18) v1(43.81,26.42)
VS1: length 39.9
  Top Layer w0.254: 21.27,34.04 23.62,34.04 24.36,33.3 U12.12
  Top Layer w0.381: C30.1 21.78,34.67 23.47,34.67 23.5,34.7
  内电 w0.381: v1(35.36,57.23) 35.36,51.49 33.54,49.67 33.54,35.05 33.16,34.67 23.52,34.67 23.5,34.7
  vias: v1(30.91,60.4) v1(30.91,59.77) v1(30.91,59.13) v1(30.91,58.5) v1(30.91,57.86) v1(30.91,57.23) v1(31.55,60.4) v1(31.55,59.77) v1(31.55,59.13) v1(31.55,58.5) v1(31.55,57.86) v1(31.55,57.23) v1(32.18,60.4) v1(32.18,59.77) v1(32.18,59.13) v1(32.18,58.5) v1(32.18,57.86) v1(32.18,57.23) v1(32.82,60.4) v1(32.82,59.77) v1(32.82,59.13) v1(32.82,58.5) v1(32.82,57.86) v1(32.82,57.23) v1(33.45,60.4) v1(33.45,59.77) v1(33.45,59.13) v1(33.45,58.5) v1(33.45,57.86) v1(33.45,57.23) v1(34.09,60.4) v1(34.09,59.77) v1(34.09,59.13) v1(34.09,58.5) v1(34.09,57.86) v1(34.09,57.23) v1(34.72,60.4) v1(34.72,59.77) v1(34.72,59.13) v1(34.72,58.5) v1(34.72,57.86) v1(34.72,57.23) v1(35.36,60.4) v1(35.36,59.77) v1(35.36,59.13) v1(35.36,58.5) v1(35.36,57.86) v1(35.99,60.4) v1(35.99,59.77) v1(35.99,59.13) v1(35.99,58.5) v1(35.99,57.86) v1(35.99,57.23) v1(36.63,60.4) v1(36.63,59.77) v1(36.63,59.13) v1(36.63,58.5) v1(36.63,57.86) v1(36.63,57.23) v1(37.26,60.4) v1(37.26,59.77) v1(37.26,59.13) v1(37.26,58.5) v1(37.26,57.86) v1(37.26,57.23) v1(37.9,60.4) v1(37.9,59.77) v1(37.9,59.13) v1(37.9,58.5) v1(37.9,57.86) v1(37.9,57.23) v1(38.53,60.4) v1(38.53,59.77) v1(38.53,59.13) v1(38.53,58.5) v1(38.53,57.86) v1(38.53,57.23) v1(39.17,60.4) v1(39.17,59.77) v1(39.17,59.13) v1(39.17,58.5) v1(39.17,57.86) v1(39.17,57.23) v1(39.8,60.4) v1(39.8,59.77) v1(39.8,59.13) v1(39.8,58.5) v1(39.8,57.86) v1(39.8,57.23)
vs1:
  vias: v2(23.5,34.7)
VS2: length 29.7
  Top Layer w0.254: 21.15,31.62 22.48,31.62 22.98,31.12 23.7,31.12
  Top Layer w0.381: v2(21.46,32.52) 21.46,31.75 21.34,31.62 21.34,31.56 C41.1
  内电 w0.381: v2(21.46,32.52) 21.48,32.53 21.48,49.8 23.29,51.61 v1(23.29,57.23)
  vias: v1(18.85,60.4) v1(18.85,59.77) v1(18.85,59.13) v1(18.85,58.5) v1(18.85,57.86) v1(18.85,57.23) v1(19.48,60.4) v1(19.48,59.77) v1(19.48,59.13) v1(19.48,58.5) v1(19.48,57.86) v1(19.48,57.23) v1(20.12,60.4) v1(20.12,59.77) v1(20.12,59.13) v1(20.12,58.5) v1(20.12,57.86) v1(20.12,57.23) v1(20.75,60.4) v1(20.75,59.77) v1(20.75,59.13) v1(20.75,58.5) v1(20.75,57.86) v1(20.75,57.23) v1(21.39,60.4) v1(21.39,59.77) v1(21.39,59.13) v1(21.39,58.5) v1(21.39,57.86) v1(21.39,57.23) v1(22.02,60.4) v1(22.02,59.77) v1(22.02,59.13) v1(22.02,58.5) v1(22.02,57.86) v1(22.02,57.23) v1(22.66,60.4) v1(22.66,59.77) v1(22.66,59.13) v1(22.66,58.5) v1(22.66,57.86) v1(22.66,57.23) v1(23.29,60.4) v1(23.29,59.77) v1(23.29,59.13) v1(23.29,58.5) v1(23.29,57.86) v1(23.93,60.4) v1(23.93,59.77) v1(23.93,59.13) v1(23.93,58.5) v1(23.93,57.86) v1(23.93,57.23) v1(24.56,60.4) v1(24.56,59.77) v1(24.56,59.13) v1(24.56,58.5) v1(24.56,57.86) v1(24.56,57.23) v1(25.2,60.4) v1(25.2,59.77) v1(25.2,59.13) v1(25.2,58.5) v1(25.2,57.86) v1(25.2,57.23) v1(25.83,60.4) v1(25.83,59.77) v1(25.83,59.13) v1(25.83,58.5) v1(25.83,57.86) v1(25.83,57.23) v1(26.47,60.4) v1(26.47,59.77) v1(26.47,59.13) v1(26.47,58.5) v1(26.47,57.86) v1(26.47,57.23) v1(27.1,60.4) v1(27.1,59.77) v1(27.1,59.13) v1(27.1,58.5) v1(27.1,57.86) v1(27.1,57.23) v1(27.74,60.4) v1(27.74,59.77) v1(27.74,59.13) v1(27.74,58.5) v1(27.74,57.86) v1(27.74,57.23) v1(28.37,60.4) v1(28.37,59.77) v1(28.37,59.13) v1(28.37,58.5) v1(28.37,57.86) v1(28.37,57.23)
VS3: length 39.3
  Top Layer w0.254: 21.08,28.83 21.97,28.83 22.76,29.62 23.7,29.62
  Top Layer w0.381: 20.89,28.58 21.08,28.76 21.08,28.83 21.06,28.85 v2(21.06,29.85)
  内电 w0.381: v1(11.35,57.23) 12.08,56.5 12.08,37.58 13.59,36.07 19.69,36.07 20.7,35.05 20.7,31.88 21.06,31.52 v2(21.06,29.85)
  vias: v1(6.91,60.4) v1(6.91,59.77) v1(6.91,59.13) v1(6.91,58.5) v1(6.91,57.86) v1(6.91,57.23) v1(7.54,60.4) v1(7.54,59.77) v1(7.54,59.13) v1(7.54,58.5) v1(7.54,57.86) v1(7.54,57.23) v1(8.18,60.4) v1(8.18,59.77) v1(8.18,59.13) v1(8.18,58.5) v1(8.18,57.86) v1(8.18,57.23) v1(8.81,60.4) v1(8.81,59.77) v1(8.81,59.13) v1(8.81,58.5) v1(8.81,57.86) v1(8.81,57.23) v1(9.45,60.4) v1(9.45,59.77) v1(9.45,59.13) v1(9.45,58.5) v1(9.45,57.86) v1(9.45,57.23) v1(10.08,60.4) v1(10.08,59.77) v1(10.08,59.13) v1(10.08,58.5) v1(10.08,57.86) v1(10.08,57.23) v1(10.72,60.4) v1(10.72,59.77) v1(10.72,59.13) v1(10.72,58.5) v1(10.72,57.86) v1(10.72,57.23) v1(11.35,60.4) v1(11.35,59.77) v1(11.35,59.13) v1(11.35,58.5) v1(11.35,57.86) v1(11.99,60.4) v1(11.99,59.77) v1(11.99,59.13) v1(11.99,58.5) v1(11.99,57.86) v1(11.99,57.23) v1(12.62,60.4) v1(12.62,59.77) v1(12.62,59.13) v1(12.62,58.5) v1(12.62,57.86) v1(12.62,57.23) v1(13.26,60.4) v1(13.26,59.77) v1(13.26,59.13) v1(13.26,58.5) v1(13.26,57.86) v1(13.26,57.23) v1(13.89,60.4) v1(13.89,59.77) v1(13.89,59.13) v1(13.89,58.5) v1(13.89,57.86) v1(13.89,57.23) v1(14.53,60.4) v1(14.53,59.77) v1(14.53,59.13) v1(14.53,58.5) v1(14.53,57.86) v1(14.53,57.23) v1(15.16,60.4) v1(15.16,59.77) v1(15.16,59.13) v1(15.16,58.5) v1(15.16,57.86) v1(15.16,57.23) v1(15.8,60.4) v1(15.8,59.77) v1(15.8,59.13) v1(15.8,58.5) v1(15.8,57.86) v1(15.8,57.23)
WS2812_MOSI: length 3.6
  Top Layer w0.254: U1.54 17.64,16.64 16.51,16.64 15.32,15.45 LED3.3
$1N49: length 2.1
  Top Layer w0.508: C7.1 37.28,23.77 U3.6
$1N50: length 5.8
  Top Layer w0.508: C7.2 40.13,22.73 40.88,23.48 40.88,23.8
  Top Layer w0.635: U3.2 40.34,25.45 40.88,24.91 40.88,23.8
$1N52: length 5.5
  Top Layer w0.254: R3.1 34.8,24.52 34.8,26.16 35.05,26.42 36.53,26.42 ; 36.53,26.42 36.07,26.88 36.07,27.82 R4.2 ; 36.53,26.42 U3.4
$1N77: length 2.5
  Top Layer w0.254: R5.2 41.87,16.39 LED1.2
$1N164: length 10.7
  Top Layer w0.254: R7.1 35.12,45.28 35.43,45.59 35.43,53.67 35.61,53.85 36.29,53.85 36.54,53.59 Q1.4
$1N166: length 10.8
  Top Layer w0.254: Q2.4 24.02,53.98 23.5,53.98 23.37,53.85 23.37,45.47 23.23,45.33 R9.1
$1N168: length 10.5
  Top Layer w0.254: R10.1 11.29,45.33 11.56,45.59 11.56,53.34 12.06,53.85 12.32,53.85 12.53,53.64 Q3.4
$1N170: length 1.9
  Top Layer w0.254: R14.1 34.41,50.34 Q4.4
$1N172: length 1.9
  Top Layer w0.254: R16.1 22.35,50.35 Q5.4
$1N174: length 1.8
  Top Layer w0.254: R17.1 Q6.4
$1N184: length 3.5
  Top Layer w0.254: R21.1 27.91,38.98 U13.5
$1N200: length 3.4
  Top Layer w0.254: R24.1 R25.2 15.86,38.85 U6.5
$1N210: length 3.1
  Top Layer w0.254: U11.5 4.15,39.49 R27.1
$1N250: length 5.5
  Top Layer w0.254: 31.33,21.72 30.7,22.35 27.56,22.35 27.1,21.89 U1.33
$1N251: length 2.2
  Top Layer w0.254: R32.2 32.9,22.1 LED2.1
$1N369: length 1.7
  Top Layer w0.254: U7.8 8.79,24.02 R8.1
$1N380: length 1.7
  Top Layer w0.254: U8.6 39.43,34.61 39.43,35.81
$1N382: length 3.9
  Top Layer w0.254: 40.4,28.96 40.38,28.99 R40.2 40.38,30.61 40.13,30.86 39.5,30.86 39.07,31.29 U8.1
$1N383: length 8.3
  Top Layer w0.254: L5.1 37.3,34.64 38.17,35.51 38.17,36.14 38.61,36.58 40.07,36.58 C43.1 40.02,35 U8.5
$1N387: length 1.4
  Top Layer w0.254: U13.1 30.29,37.01 R1.1
$1N389: length 1.2
  Top Layer w0.254: U6.1 18.17,36.85 R2.2
$1N391: length 1.7
  Top Layer w0.254: U11.1 6.61,38.37 R39.1

## Copper pours and planes (outline as drawn; the poured copper is in the pictures)
+3.3V on Top Layer: 43.25,18.41 46.35,18.41 46.35,14.48 43.25,14.48
+3.3V on Top Layer: 28.45,9.91 32.51,9.91 32.51,6.99 28.45,6.99
+3.3V on 内电: 3.43,17.15 50.55,17.15 50.55,12.83 3.43,12.83
+3.3V on 内电: 28.07,18.54 33.66,18.54 33.66,4.32 28.07,4.32
+3.3V on 内电: 43.31,18.29 46.35,18.29 46.35,14.48 43.31,14.48
+3.3V on 内电: 7.87,30.86 11.86,30.86 11.86,28.25 7.87,28.25
+3.3V on 内电: 7.16,38.03 11.43,38.03 11.43,32.13 7.16,32.13
+3.3V on 内电: 3.28,37.96 8.89,37.96 8.89,12.95 3.28,12.95
+3.3V on 内电: 17.15,11.81 18.99,11.81 18.99,8.49 17.15,8.49
+3.3V on 内电: 17.15,10.92 33.53,10.92 33.53,8.51 17.15,8.51
+3.3V on 内电: 19.1,19.95 21.34,19.95 21.34,12.95 19.1,12.95
+5V on Top Layer: 34.26,23.42 36.44,23.42 36.44,20.25 34.26,20.25
+5V on Top Layer: 43.54,21.97 43.54,25.55 43.51,25.58 43.51,25.91 45.85,25.91 45.85,20.31 44.25,20.27 44.25,18.98 39.5,18.98 39.51,20.25 34,20.25 34,21.97
+5V on 内电: 13.73,31.83 15.62,31.83 15.62,20.83 13.73,20.83
+5V on 内电: 13.88,21.72 15.49,21.72 15.49,17.15 13.88,17.15
+5V on 内电: 13.84,22.35 45.87,22.35 45.87,20.29 13.84,20.29
+5V on 内电: 12.83,31.88 15.37,31.88 15.37,30.61 12.83,30.61
GND on Top Layer: 34,19.97 39.12,19.97 39.12,17.15 34,17.15
GND on Top Layer: 37,27 39.62,27 39.62,24.13 37,24.13
GND on Top Layer: 37.85,18.8 42.36,18.8 42.36,17.24 37.85,17.24
GND on Top Layer: -0.51,38.1 49.02,38.1 49.02,-1.65 -0.51,-1.65
GND on Top Layer: 42.75,37.72 47.29,37.72 47.29,36.16 42.75,36.16
GND on Bottom Layer: -0.76,37.97 49.28,37.97 49.28,-0.38 -0.76,-0.38
GND on 内地: -0.76,38.21 50.67,38.21 50.67,-0.76 -0.76,-0.76
PGND on Top Layer: 36.07,43.69 48.9,43.69 48.9,38.23 36.07,38.23
PGND on Top Layer: 0.25,51.82 3.56,51.82 3.56,41.02 0.25,41.02
PGND on Top Layer: 11.86,46.7 15.44,46.7 15.44,40.76 11.86,40.76
PGND on Top Layer: 0.38,43.18 4.44,43.18 4.44,41.02 0.38,41.02
PGND on Top Layer: 21.7,43.03 28.19,43.03 28.19,40.64 21.7,40.64
PGND on Top Layer: 23.98,46.84 27.56,46.84 27.56,40.64 23.98,40.64
PGND on Top Layer: 10.34,42.86 16.06,42.86 16.06,40.32 10.34,40.32
PGND on Bottom Layer: -3.05,52.07 49.24,52.07 49.24,38.23 -3.05,38.23
PGND on 内地: -1.65,62.48 48.64,62.48 48.64,38.35 -1.65,38.35
VCC_Input on Top Layer: 39.63,33.31 47.88,33.31 47.88,30.73 39.63,30.73
VCC_Input on Top Layer: 36.05,51.41 49.02,51.41 49.02,44.07 36.05,44.07
VCC_Input on Bottom Layer: 5.72,52.07 47.88,52.07 47.88,44.07 5.72,44.07
VCC_Input on 内电: 39.38,34.54 48.01,34.54 48.01,30.61 39.38,30.61
VCC_Input on 内电: 36.05,49.32 47.88,49.32 47.88,44.07 36.05,44.07
VCC_Input on 内电: 36.02,49.24 42.16,49.24 42.16,30.61 36.02,30.61
L1+ on Top Layer: 33.52,50.97 33.52,47.57 32.88,46.93 32.88,43.55 32.91,43.52 30.87,43.52 30.87,46.91 30.23,47.55 30.23,50.97
L2+ on Top Layer: 21.45,50.97 21.45,47.57 20.81,46.93 20.81,43.55 20.85,43.52 18.81,43.52 18.81,46.91 18.17,47.55 18.17,50.97
L3+ on Top Layer: 9.5,50.89 9.5,47.48 8.86,46.84 8.86,43.47 8.89,43.43 6.85,43.43 6.85,46.83 6.21,47.46 6.21,50.89
VGS on Top Layer: 14.99,34.93 16.99,34.93 16.99,28.1 14.99,28.1
VGS on Top Layer: 11.05,34.93 16.89,34.93 16.89,32.25 11.05,32.25
VGS on Top Layer: 38.61,29.49 40.42,29.49 40.42,26.04 38.61,26.04
VGS on Top Layer: 34.35,30.67 34.51,30.83 40.29,30.83 40.39,30.73 40.39,30.42 44.58,30.42 44.58,26.06 39.7,26.06 39.7,28.88 39.37,29.21 34.35,29.21
VGS on Bottom Layer: 38.73,28.19 46.03,28.19 46.03,24.32 38.73,24.32
VGS on 内电: 15.99,34.76 19.4,34.76 19.4,22.32 15.99,22.32
VGS on 内电: 38.5,30.37 44.63,30.37 44.63,22.18 38.5,22.18
VGS on 内电: 11.05,34.93 19.31,34.93 19.31,32.14 11.05,32.14
VGS on 内电: 16,25.3 42.73,25.3 42.73,22.56 16,22.56
VS1 on Top Layer: 29.92,61.85 40.81,61.85 40.81,54.9 29.92,54.9
VS1 on Top Layer: 37.46,63.75 40.77,63.75 40.77,52.78 37.46,52.78
VS2 on Top Layer: 25.4,63.91 28.7,63.91 28.7,52.93 25.4,52.93
VS2 on Top Layer: 17.79,61.64 28.69,61.64 28.69,54.69 17.79,54.69
VS3 on Top Layer: 5.86,61.64 16.75,61.64 16.75,54.69 5.86,54.69
VS3 on Top Layer: 13.46,63.78 16.76,63.78 16.76,52.81 13.46,52.81
$1N50 on Top Layer: 38.73,25.78 41.78,25.78 41.78,22.37 39.99,22.37 39.99,25.15 38.73,25.15

Small or netless copper shapes (teardrops, artwork), in the pictures only: 2 on Top Layer
